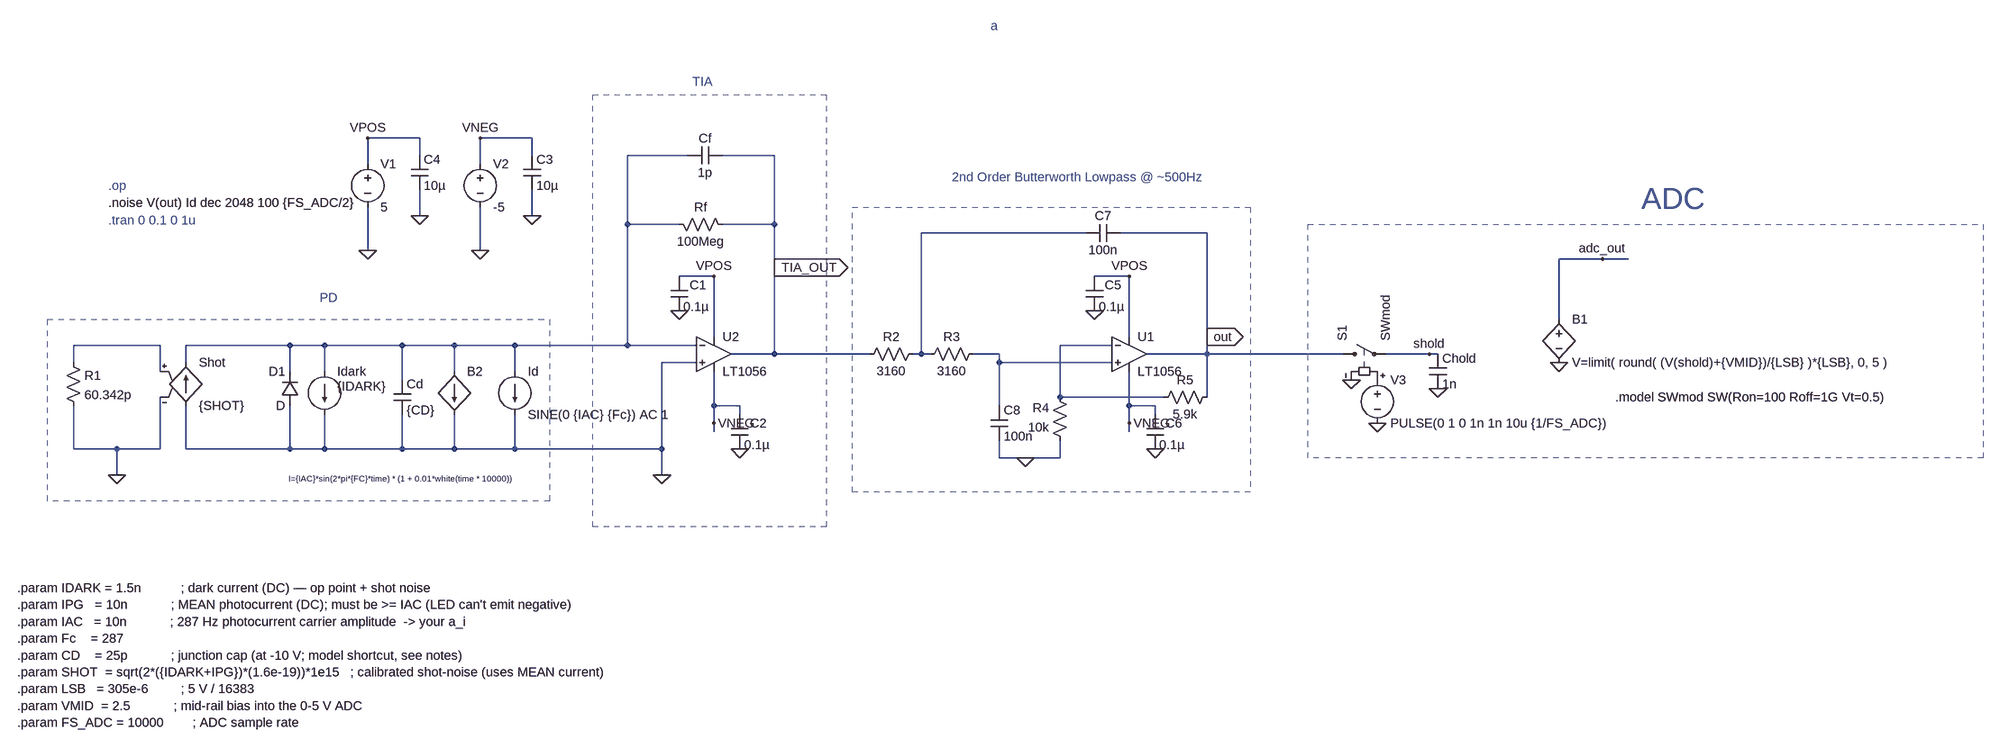
[diagram p0: schematic circuit.asc]
circuit.asc, the LTspice schematic file:
Version 4
SHEET 1 4020 760
WIRE 480 -896 384 -896
WIRE 688 -896 592 -896
WIRE 480 -864 480 -896
WIRE 688 -864 688 -896
WIRE 976 -864 864 -864
WIRE 1136 -864 1040 -864
WIRE 384 -848 384 -896
WIRE 592 -848 592 -896
WIRE 480 -752 480 -800
WIRE 688 -752 688 -800
WIRE 864 -736 864 -864
WIRE 960 -736 864 -736
WIRE 1136 -736 1136 -864
WIRE 1136 -736 1040 -736
WIRE 1712 -720 1408 -720
WIRE 1936 -720 1776 -720
WIRE 384 -688 384 -768
WIRE 592 -688 592 -768
WIRE 2672 -672 2592 -672
WIRE 2720 -672 2672 -672
WIRE 1136 -656 1136 -736
WIRE 1024 -640 960 -640
WIRE 1792 -640 1728 -640
WIRE 2592 -560 2592 -672
WIRE 1024 -528 1024 -640
WIRE 1792 -528 1792 -640
WIRE 1936 -528 1936 -720
WIRE 0 -512 -160 -512
WIRE 240 -512 48 -512
WIRE 304 -512 240 -512
WIRE 448 -512 304 -512
WIRE 544 -512 448 -512
WIRE 656 -512 544 -512
WIRE 864 -512 864 -736
WIRE 864 -512 656 -512
WIRE 992 -512 864 -512
WIRE 1760 -512 1664 -512
WIRE 1136 -496 1136 -656
WIRE 1136 -496 1056 -496
WIRE 1312 -496 1136 -496
WIRE 1408 -496 1408 -720
WIRE 1408 -496 1392 -496
WIRE 1424 -496 1408 -496
WIRE 1552 -496 1504 -496
WIRE 1936 -496 1936 -528
WIRE 1936 -496 1824 -496
WIRE 2192 -496 1936 -496
WIRE 2352 -496 2272 -496
WIRE 2368 -496 2352 -496
WIRE -160 -480 -160 -512
WIRE 48 -480 48 -512
WIRE 992 -480 928 -480
WIRE 1552 -480 1552 -496
WIRE 1760 -480 1552 -480
WIRE 0 -464 0 -512
WIRE 240 -464 240 -512
WIRE 304 -464 304 -512
WIRE 544 -464 544 -512
WIRE 656 -464 656 -512
WIRE 448 -448 448 -512
WIRE 1664 -416 1664 -512
WIRE 1856 -416 1664 -416
WIRE 1936 -416 1936 -496
WIRE 1024 -400 1024 -464
WIRE 1072 -400 1024 -400
WIRE 1552 -400 1552 -480
WIRE 1792 -400 1792 -464
WIRE 1840 -400 1792 -400
WIRE 1072 -384 1072 -400
WIRE 1840 -384 1840 -400
WIRE 1024 -368 1024 -400
WIRE 1792 -368 1792 -400
WIRE 1024 -352 1024 -368
WIRE 1792 -352 1792 -368
WIRE -160 -320 -160 -400
WIRE -80 -320 -160 -320
WIRE 0 -320 0 -416
WIRE 0 -320 -80 -320
WIRE 48 -320 48 -400
WIRE 240 -320 240 -400
WIRE 240 -320 48 -320
WIRE 304 -320 304 -384
WIRE 304 -320 240 -320
WIRE 448 -320 448 -384
WIRE 448 -320 304 -320
WIRE 544 -320 544 -384
WIRE 544 -320 448 -320
WIRE 656 -320 656 -384
WIRE 656 -320 544 -320
WIRE 928 -320 928 -480
WIRE 928 -320 656 -320
WIRE 1552 -304 1552 -336
WIRE 1600 -304 1552 -304
WIRE 1664 -304 1664 -336
WIRE 1664 -304 1600 -304
WIRE -80 -272 -80 -320
WIRE 928 -272 928 -320
FLAG 592 -896 VNEG
FLAG 1024 -640 VPOS
FLAG 1024 -368 VNEG
FLAG 384 -896 VPOS
FLAG -80 -272 0
FLAG 960 -576 0
FLAG 1072 -320 0
FLAG 688 -752 0
FLAG 480 -752 0
FLAG 384 -688 0
FLAG 592 -688 0
FLAG 928 -272 0
FLAG 2592 -480 0
FLAG 2352 -496 shold
FLAG 1792 -640 VPOS
FLAG 1792 -368 VNEG
FLAG 1728 -576 0
FLAG 1840 -320 0
FLAG 1600 -304 0
FLAG 1936 -528 out
IOPIN 1936 -528 Out
FLAG 2256 -368 0
FLAG 2208 -448 0
FLAG 2368 -432 0
FLAG 2672 -672 adc_out
FLAG 1136 -656 TIA_OUT
IOPIN 1136 -656 Out
SYMBOL res 944 -752 M90
WINDOW 0 0 56 VBottom 2
WINDOW 3 32 56 VTop 2
SYMATTR InstName Rf
SYMATTR Value 100Meg
SYMATTR SpiceLine tol=1 pwr=0.1
SYMBOL cap 1040 -880 R90
WINDOW 0 0 32 VBottom 2
WINDOW 3 32 32 VTop 2
SYMATTR InstName Cf
SYMATTR Value 1p
SYMATTR SpiceLine V=25 Irms=0 Rser=0 Lser=0
SYMBOL voltage 384 -864 R0
WINDOW 123 0 0 Left 0
WINDOW 39 0 0 Left 0
SYMATTR InstName V1
SYMATTR Value 5
SYMBOL voltage 592 -864 R0
WINDOW 123 0 0 Left 0
WINDOW 39 0 0 Left 0
SYMATTR InstName V2
SYMATTR Value -5
SYMBOL cap 432 -448 R0
SYMATTR InstName Cd
SYMATTR Value {CD}
SYMBOL current 304 -464 R0
WINDOW 39 0 0 Left 0
WINDOW 3 24 28 Left 2
SYMATTR Value {IDARK}
SYMATTR Value2 AC 0 0
SYMATTR InstName Idark
SYMBOL g 48 -496 R0
SYMATTR InstName Shot
SYMATTR Value {SHOT}
SYMBOL res -176 -496 R0
SYMATTR InstName R1
SYMATTR Value 60.342p
SYMBOL cap 944 -640 R0
WINDOW 0 35 16 Left 2
SYMATTR InstName C1
SYMATTR Value 0.1µ
SYMBOL cap 1056 -384 R0
WINDOW 0 35 16 Left 2
SYMATTR InstName C2
SYMATTR Value 0.1µ
SYMBOL cap 672 -864 R0
SYMATTR InstName C3
SYMATTR Value 10µ
SYMBOL cap 464 -864 R0
SYMATTR InstName C4
SYMATTR Value 10µ
SYMBOL diode 256 -400 R180
WINDOW 0 24 64 Left 2
WINDOW 3 24 0 Left 2
SYMATTR InstName D1
SYMBOL bv 2592 -576 R0
SYMATTR InstName B1
SYMATTR Value V=limit( round( (V(shold)+{VMID})/{LSB} )*{LSB}, 0, 5 )
SYMBOL OpAmps\\LT1056 1024 -560 R0
SYMATTR InstName U2
SYMBOL bi 544 -464 R0
WINDOW 3 -306 199 Left 1
SYMATTR Value I={IAC}*sin(2*pi*{FC}*time) * (1 + 0.01*white(time * 10000))
SYMATTR InstName B2
SYMBOL cap 1712 -640 R0
WINDOW 0 35 16 Left 2
SYMATTR InstName C5
SYMATTR Value 0.1µ
SYMBOL cap 1824 -384 R0
WINDOW 0 35 16 Left 2
SYMATTR InstName C6
SYMATTR Value 0.1µ
SYMBOL OpAmps\\LT1056 1792 -560 R0
SYMATTR InstName U1
SYMBOL res 1408 -512 R90
WINDOW 0 0 56 VBottom 2
WINDOW 3 32 56 VTop 2
SYMATTR InstName R2
SYMATTR Value 3160
SYMBOL res 1520 -512 R90
WINDOW 0 0 56 VBottom 2
WINDOW 3 32 56 VTop 2
SYMATTR InstName R3
SYMATTR Value 3160
SYMBOL res 1680 -320 R180
WINDOW 0 36 76 Left 2
WINDOW 3 36 40 Left 2
SYMATTR InstName R4
SYMATTR Value 10k
SYMBOL res 1840 -400 R270
WINDOW 0 32 56 VTop 2
WINDOW 3 0 56 VBottom 2
SYMATTR InstName R5
SYMATTR Value 5.9k
SYMBOL cap 1712 -704 R270
WINDOW 0 32 32 VTop 2
WINDOW 3 0 32 VBottom 2
SYMATTR InstName C7
SYMATTR Value 100n
SYMBOL cap 1536 -400 R0
SYMATTR InstName C8
SYMATTR Value 100n
SYMBOL voltage 2256 -464 R0
WINDOW 123 0 0 Left 0
WINDOW 39 0 0 Left 0
SYMATTR InstName V3
SYMATTR Value PULSE(0 1 0 1n 1n 10u {1/FS_ADC})
SYMBOL sw 2176 -496 R270
SYMATTR InstName S1
SYMATTR Value SWmod
SYMBOL cap 2352 -496 R0
SYMATTR InstName Chold
SYMATTR Value 1n
SYMBOL current 656 -464 R0
SYMATTR InstName Id
SYMATTR Value SINE(0 {IAC} {Fc}) AC 1
TEXT 312 -600 Center 2 ;PD
TEXT -96 -776 Left 2 !.noise V(out) Id dec 2048 100 {FS_ADC/2}
TEXT -96 -808 Left 2 ;.op
TEXT -96 -744 Left 2 ;.tran 0 0.1 0 1u
TEXT 1536 -1104 Left 2 ;a
TEXT -264 152 Left 2 !.param IDARK = 1.5n           ; dark current (DC) — op point + shot noise\n.param IPG   = 10n            ; MEAN photocurrent (DC); must be >= IAC (LED can't emit negative)\n.param IAC   = 10n            ; 287 Hz photocurrent carrier amplitude  -> your a_i\n.param Fc    = 287\n.param CD    = 25p            ; junction cap (at -10 V; model shortcut, see notes)\n.param SHOT  = sqrt(2*({IDARK+IPG})*(1.6e-19))*1e15   ; calibrated shot-noise (uses MEAN current)\n.param LSB   = 305e-6         ; 5 V / 16383\n.param VMID  = 2.5            ; mid-rail bias into the 0-5 V ADC\n.param FS_ADC = 10000        ; ADC sample rate
TEXT 2696 -416 Left 2 !.model SWmod SW(Ron=100 Roff=1G Vt=0.5)
TEXT 2744 -784 Left 5 ;ADC
TEXT 1464 -824 Left 2 ;2nd Order Butterworth Lowpass @ ~500Hz
TEXT 984 -1000 Left 2 ;TIA
RECTANGLE Normal 1232 -176 800 -976 2
RECTANGLE Normal 720 -224 -208 -560 2
RECTANGLE Normal 2016 -240 1280 -768 2
RECTANGLE Normal 3376 -304 2128 -736 2

The netlist it stands for:
* circuit.asc
Rf N001 TIA_OUT 100Meg tol=1 pwr=0.1
Cf TIA_OUT N001 1p V=25 Irms=0 Rser=0 Lser=0
V1 VPOS 0 5
V2 VNEG 0 -5
Cd N001 0 {CD}
Idark N001 0 {IDARK} AC 0 0
G§Shot 0 N001 N003 0 {SHOT}
R1 N003 0 60.342p
C1 VPOS 0 0.1µ
C2 VNEG 0 0.1µ
C3 VNEG 0 10µ
C4 VPOS 0 10µ
D1 0 N001 D
B1 adc_out 0 V=limit( round( (V(shold)+{VMID})/{LSB} )*{LSB}, 0, 5 )
XU2 0 N001 VPOS VNEG TIA_OUT LT1056  ; pins In+ In- V+ V- OUT
B2 N001 0 I={IAC}*sin(2*pi*{FC}*time) * (1 + 0.01*white(time * 10000))
C5 VPOS 0 0.1µ
C6 VNEG 0 0.1µ
XU1 N005 N004 VPOS VNEG out LT1056  ; pins In+ In- V+ V- OUT
R2 N002 TIA_OUT 3160
R3 N005 N002 3160
R4 0 N004 10k
R5 N004 out 5.9k
C7 N002 out 100n
C8 N005 0 100n
V3 P001 0 PULSE(0 1 0 1n 1n 10u {1/FS_ADC})
S1 out shold P001 0 SWmod
Chold shold 0 1n
Id N001 0 SINE(0 {IAC} {Fc}) AC 1
.model D D
.lib standard.dio
* PD
.noise V(out) Id dec 2048 100 {FS_ADC/2}
* .op
* .tran 0 0.1 0 1u
* a
.param IDARK = 1.5n           ; dark current (DC) — op point + shot noise
.param IPG   = 10n            ; MEAN photocurrent (DC); must be >= IAC (LED can't emit negative)
.param IAC   = 10n            ; 287 Hz photocurrent carrier amplitude  -> your a_i
.param Fc    = 287
.param CD    = 25p            ; junction cap (at -10 V; model shortcut, see notes)
.param SHOT  = sqrt(2*({IDARK+IPG})*(1.6e-19))*1e15   ; calibrated shot-noise (uses MEAN current)
.param LSB   = 305e-6         ; 5 V / 16383
.param VMID  = 2.5            ; mid-rail bias into the 0-5 V ADC
.param FS_ADC = 10000        ; ADC sample rate
.model SWmod SW(Ron=100 Roff=1G Vt=0.5)
* ADC
* 2nd Order Butterworth Lowpass @ ~500Hz
* TIA
.backanno
.end